# Altium project MCP33151 Eval Board.PrjPcb (part 1 of 3)
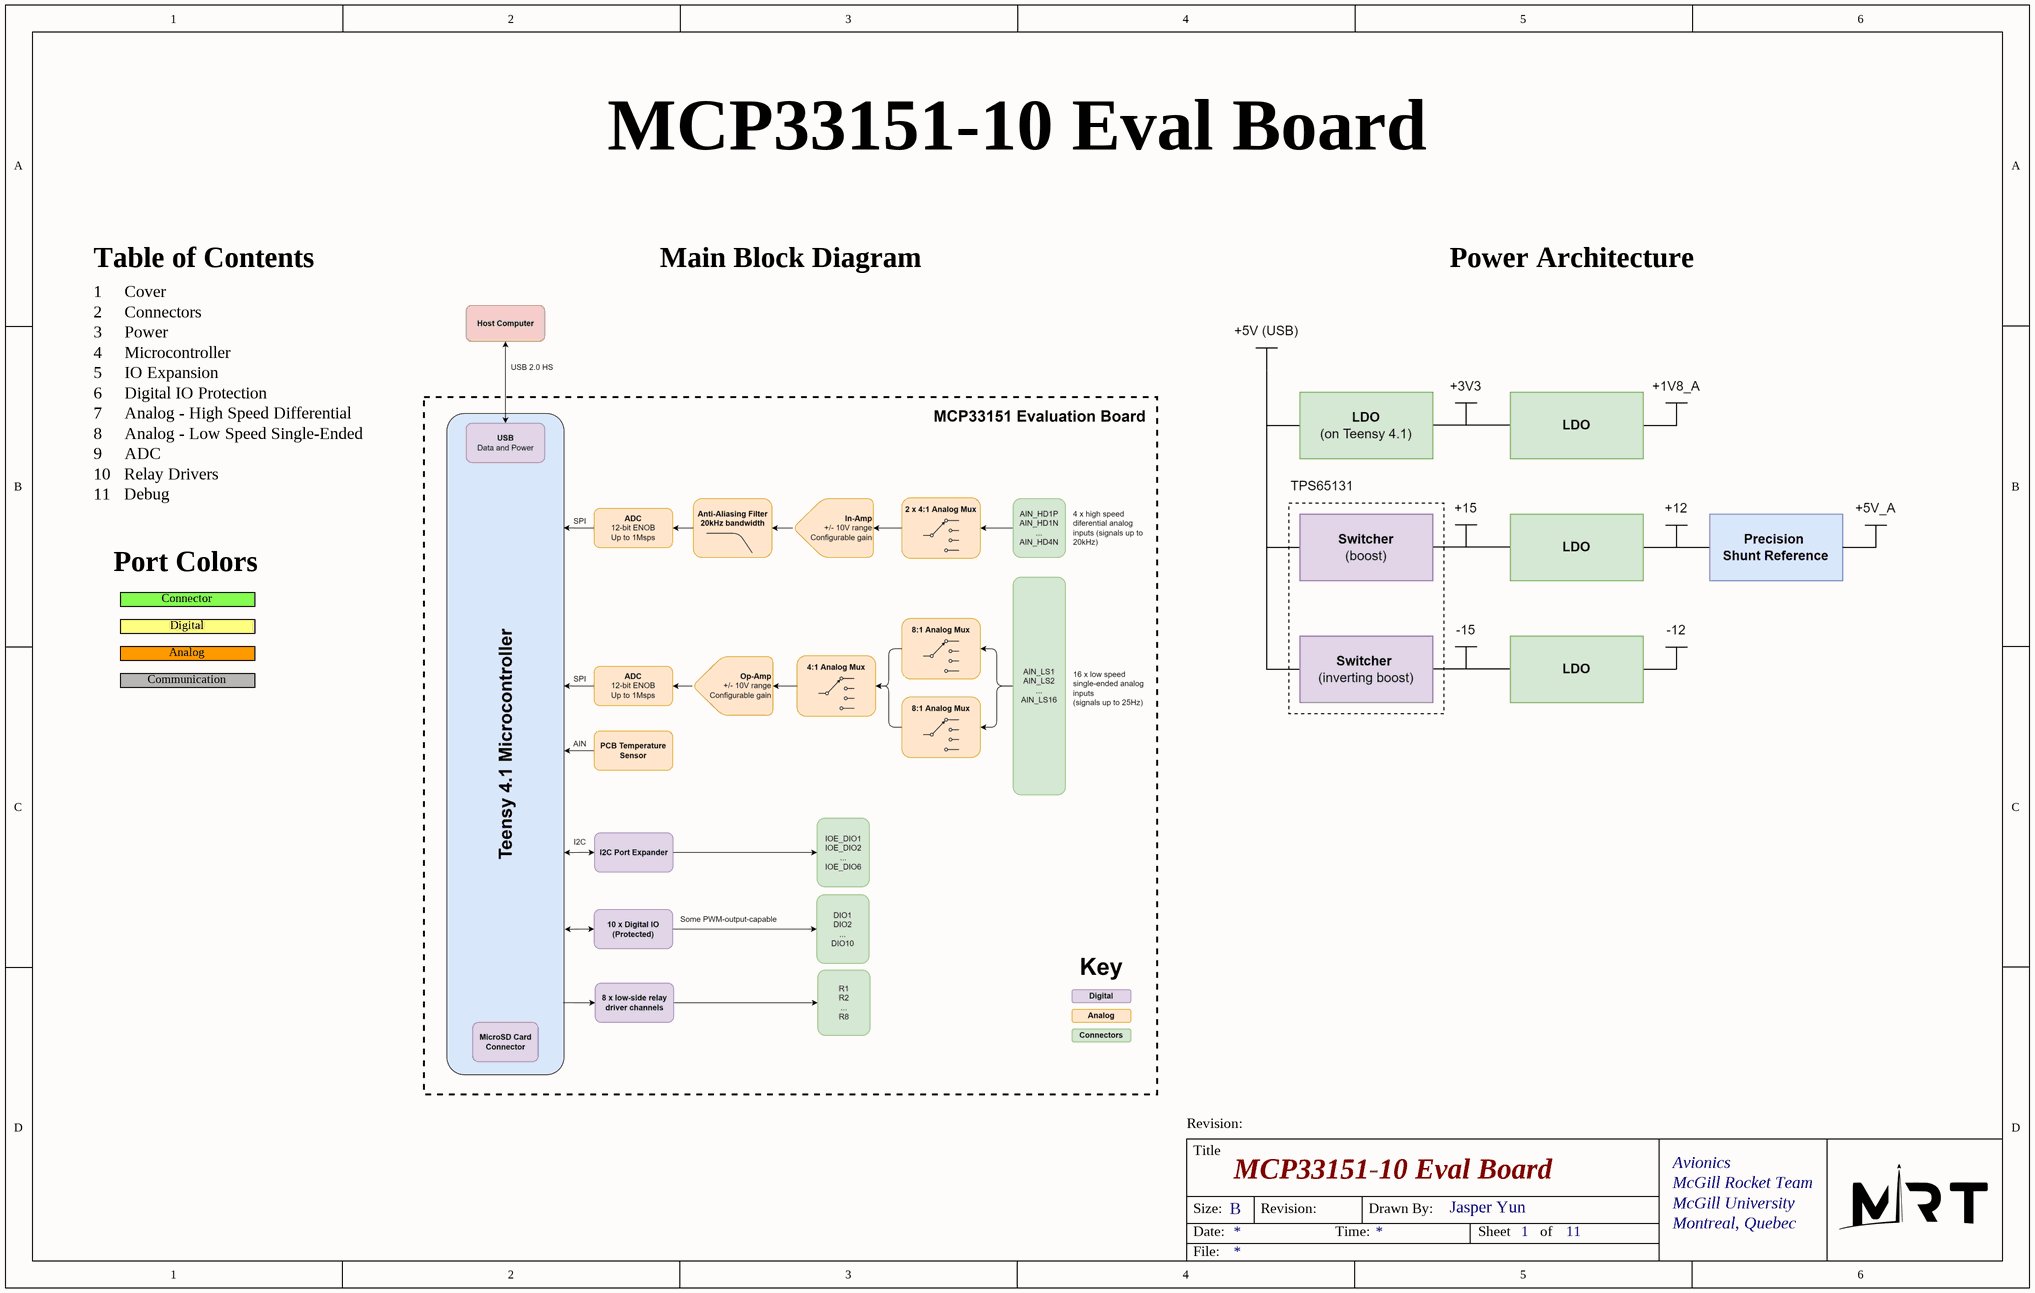
[diagram p0: Cover.SchDoc]
11 sheets, 311 parts. Net scope: flat (ports and power ports of the same name join across sheets).
Board file: MCP33151 Eval Board.PcbDoc
Sheets:
  Cover.SchDoc
  Connectors.SchDoc
  Power.SchDoc
  Microcontroller.SchDoc
  IO Expansion.SchDoc
  Digital IO Protection.SchDoc
  Analog - High Speed DE.SchDoc
  Analog - Low Speed SE.SchDoc
  ADC.SchDoc
  Relay Drivers.SchDoc
  Debug.SchDoc

## Sheet Cover.SchDoc: MCP33151-10 Eval Board
size B; DrawnBy: Jasper Yun; SheetNumber: 1; SheetTotal: 11; Competition: SAC 2021; Subteam: Avionics; University: McGill University; Location: Montreal, Quebec; Project: Avionics Project Name; MRT: McGill Rocket Team

### Notes on the sheet
- Table of Contents
- 1     Cover
- Main Block Diagram
- Power Architecture
- 2     Connectors
- 3     Power
- 4     Microcontroller
- 5     IO Expansion
- 6     Digital IO Protection
- 7     Analog - High Speed Differential
- 8     Analog - Low Speed Single-Ended
- 9     ADC
- 10   Relay Drivers
- 11   Debug
- Port Colors
- Connector
- Digital
- Analog
- Communication
- Title
- Size:
- Date:
- B
- Revision:
- Time:
- Drawn By:
- Sheet
- of
- File:

## Sheet Connectors.SchDoc: Connectors
size B; DrawnBy: Jasper Yun; SheetNumber: 2; SheetTotal: 11; Competition: SAC 2021; Subteam: Avionics; University: McGill University; Location: Montreal, Quebec; Project: Avionics Project Name; MRT: McGill Rocket Team
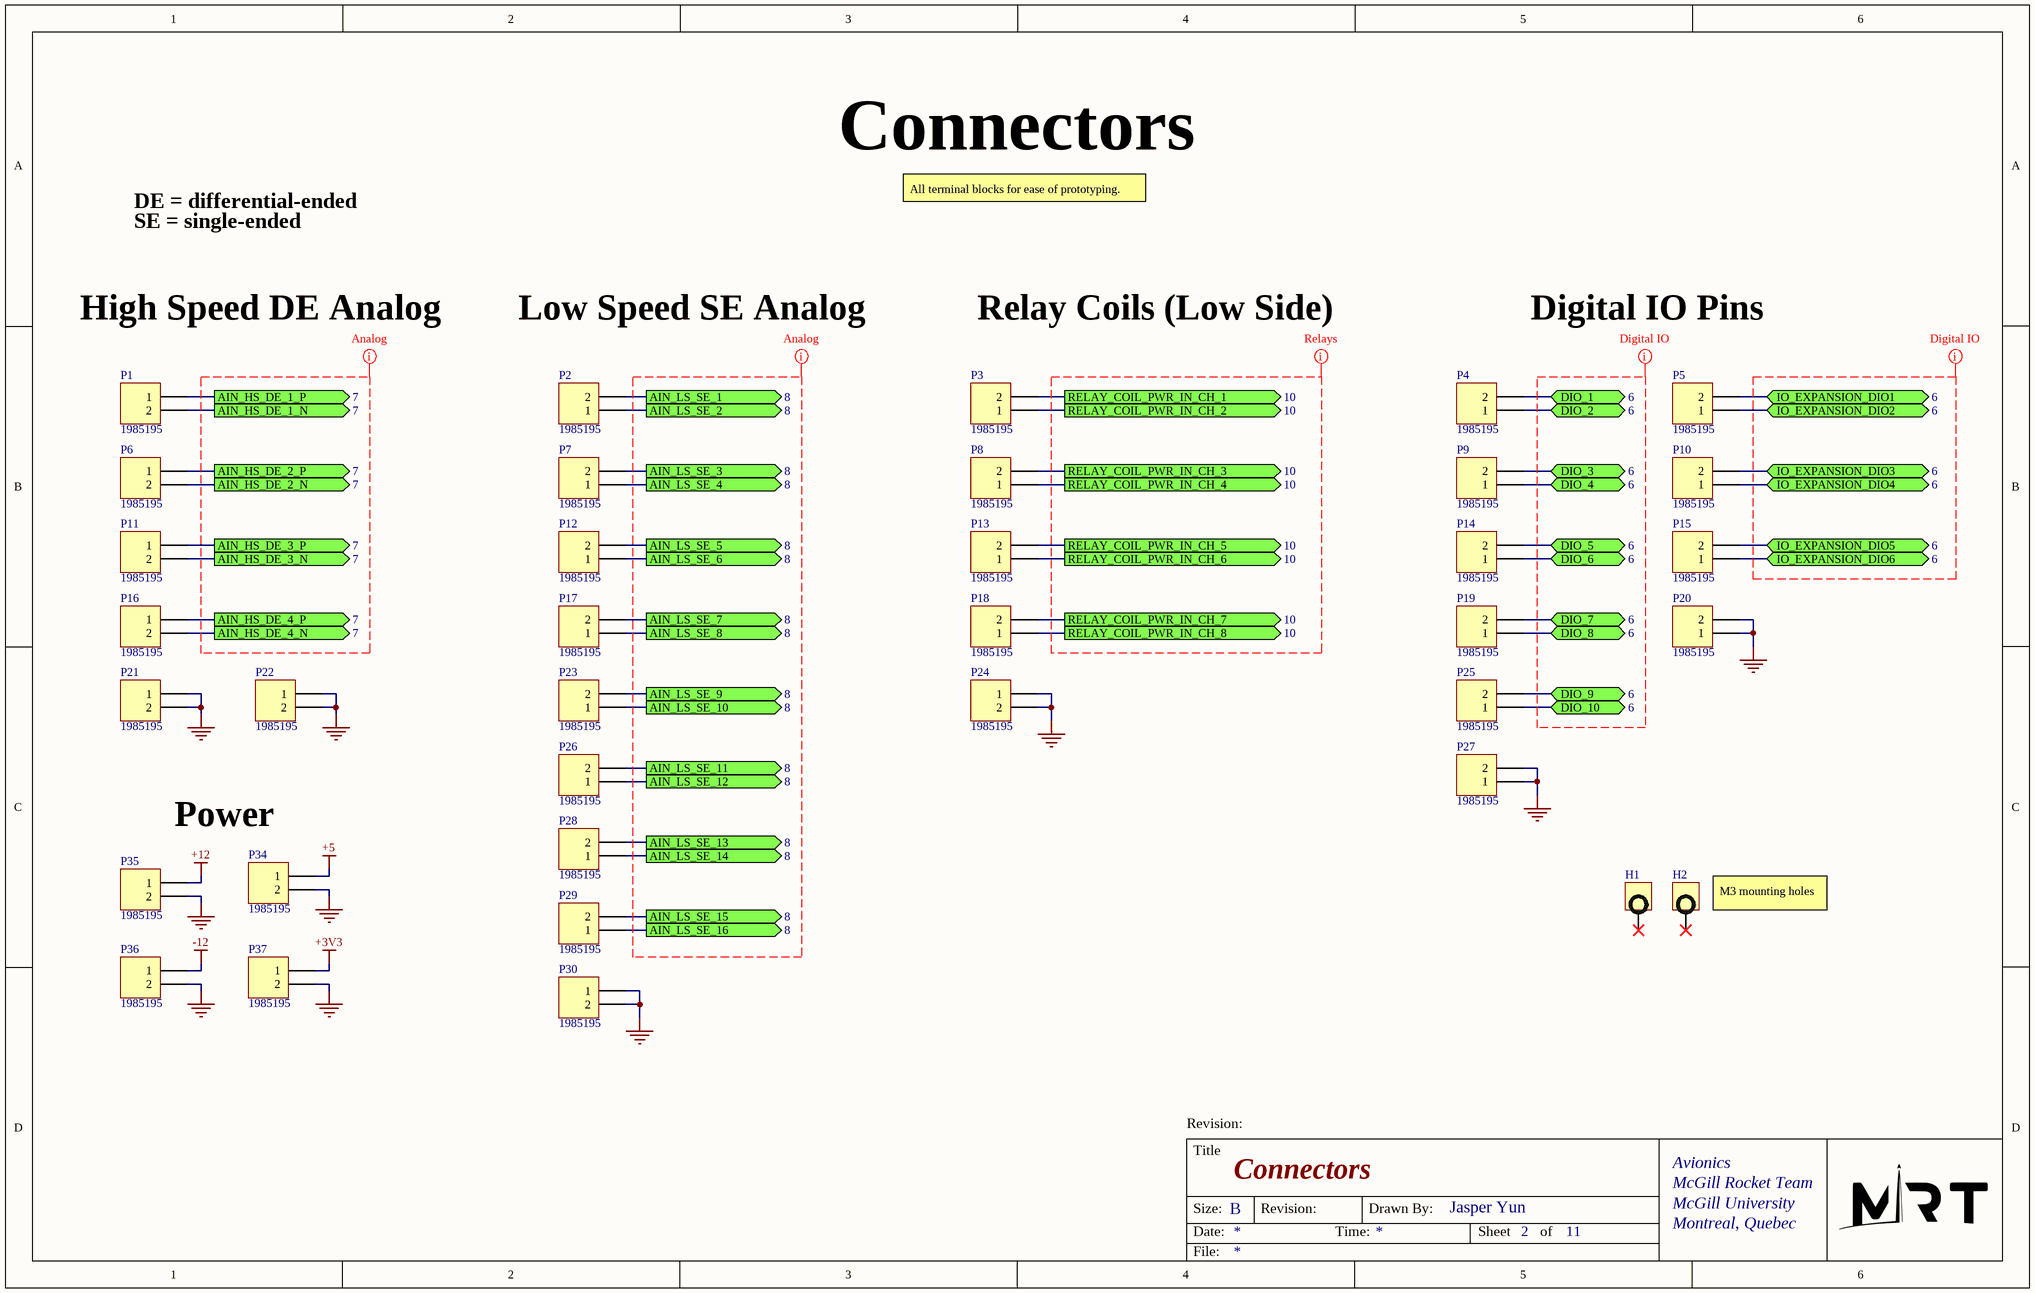
[diagram p1: Connectors.SchDoc]

### Parts
H1  M3  [HOLE M3]  (value not drawn)  (no BOM)
H2  M3  [HOLE M3]  (value not drawn)  (no BOM)
P1  1985195  [Terminal Block 1985195 2-pos 3.5mm pitch]
P2  1985195  [Terminal Block 1985195 2-pos 3.5mm pitch]
P3  1985195  [Terminal Block 1985195 2-pos 3.5mm pitch]
P4  1985195  [Terminal Block 1985195 2-pos 3.5mm pitch]
P5  1985195  [Terminal Block 1985195 2-pos 3.5mm pitch]
P6  1985195  [Terminal Block 1985195 2-pos 3.5mm pitch]
P7  1985195  [Terminal Block 1985195 2-pos 3.5mm pitch]
P8  1985195  [Terminal Block 1985195 2-pos 3.5mm pitch]
P9  1985195  [Terminal Block 1985195 2-pos 3.5mm pitch]
P10  1985195  [Terminal Block 1985195 2-pos 3.5mm pitch]
P11  1985195  [Terminal Block 1985195 2-pos 3.5mm pitch]
P12  1985195  [Terminal Block 1985195 2-pos 3.5mm pitch]
P13  1985195  [Terminal Block 1985195 2-pos 3.5mm pitch]
P14  1985195  [Terminal Block 1985195 2-pos 3.5mm pitch]
P15  1985195  [Terminal Block 1985195 2-pos 3.5mm pitch]
P16  1985195  [Terminal Block 1985195 2-pos 3.5mm pitch]
P17  1985195  [Terminal Block 1985195 2-pos 3.5mm pitch]
P18  1985195  [Terminal Block 1985195 2-pos 3.5mm pitch]
P19  1985195  [Terminal Block 1985195 2-pos 3.5mm pitch]
P20  1985195  [Terminal Block 1985195 2-pos 3.5mm pitch]
P21  1985195  [Terminal Block 1985195 2-pos 3.5mm pitch]
P22  1985195  [Terminal Block 1985195 2-pos 3.5mm pitch]
P23  1985195  [Terminal Block 1985195 2-pos 3.5mm pitch]
P24  1985195  [Terminal Block 1985195 2-pos 3.5mm pitch]
P25  1985195  [Terminal Block 1985195 2-pos 3.5mm pitch]
P26  1985195  [Terminal Block 1985195 2-pos 3.5mm pitch]
P27  1985195  [Terminal Block 1985195 2-pos 3.5mm pitch]
P28  1985195  [Terminal Block 1985195 2-pos 3.5mm pitch]
P29  1985195  [Terminal Block 1985195 2-pos 3.5mm pitch]
P30  1985195  [Terminal Block 1985195 2-pos 3.5mm pitch]
P34  1985195  [Terminal Block 1985195 2-pos 3.5mm pitch]
P35  1985195  [Terminal Block 1985195 2-pos 3.5mm pitch]
P36  1985195  [Terminal Block 1985195 2-pos 3.5mm pitch]
P37  1985195  [Terminal Block 1985195 2-pos 3.5mm pitch]

### Ports
AIN_HS_DE_1_N (out, see 7), AIN_HS_DE_1_P (out, see 7), AIN_HS_DE_2_N (out, see 7), AIN_HS_DE_2_P (out, see 7), AIN_HS_DE_3_N (out, see 7), AIN_HS_DE_3_P (out, see 7), AIN_HS_DE_4_N (out, see 7), AIN_HS_DE_4_P (out, see 7), AIN_LS_SE_1 (out, see 8), AIN_LS_SE_2 (out, see 8), AIN_LS_SE_3 (out, see 8), AIN_LS_SE_4 (out, see 8), AIN_LS_SE_5 (out, see 8), AIN_LS_SE_6 (out, see 8), AIN_LS_SE_7 (out, see 8), AIN_LS_SE_8 (out, see 8), AIN_LS_SE_9 (out, see 8), AIN_LS_SE_10 (out, see 8), AIN_LS_SE_11 (out, see 8), AIN_LS_SE_12 (out, see 8), AIN_LS_SE_13 (out, see 8), AIN_LS_SE_14 (out, see 8), AIN_LS_SE_15 (out, see 8), AIN_LS_SE_16 (out, see 8), DIO_1 (bidir, see 6), DIO_2 (bidir, see 6), DIO_3 (bidir, see 6), DIO_4 (bidir, see 6), DIO_5 (bidir, see 6), DIO_6 (bidir, see 6), DIO_7 (bidir, see 6), DIO_8 (bidir, see 6), DIO_9 (bidir, see 6), DIO_10 (bidir, see 6), IO_EXPANSION_DIO1 (bidir, see 6), IO_EXPANSION_DIO2 (bidir, see 6), IO_EXPANSION_DIO3 (bidir, see 6), IO_EXPANSION_DIO4 (bidir, see 6), IO_EXPANSION_DIO5 (bidir, see 6), IO_EXPANSION_DIO6 (bidir, see 6), RELAY_COIL_PWR_IN_CH_1 (out, see 10), RELAY_COIL_PWR_IN_CH_2 (out, see 10), RELAY_COIL_PWR_IN_CH_3 (out, see 10), RELAY_COIL_PWR_IN_CH_4 (out, see 10), RELAY_COIL_PWR_IN_CH_5 (out, see 10), RELAY_COIL_PWR_IN_CH_6 (out, see 10), RELAY_COIL_PWR_IN_CH_7 (out, see 10), RELAY_COIL_PWR_IN_CH_8 (out, see 10)

### Nets
+3V3: P37.1
+5: P34.1
+12: P35.1
-12: P36.1
GND: P20.1 P20.2 P21.1 P21.2 P22.1 P22.2 P24.1 P24.2 P27.1 P27.2 P30.1 P30.2 P34.2 P35.2 P36.2 P37.2
AIN_HS_DE_1_N: P1.2 ; port AIN_HS_DE_1_N
AIN_HS_DE_1_P: P1.1 ; port AIN_HS_DE_1_P
AIN_HS_DE_2_N: P6.2 ; port AIN_HS_DE_2_N
AIN_HS_DE_2_P: P6.1 ; port AIN_HS_DE_2_P
AIN_HS_DE_3_N: P11.2 ; port AIN_HS_DE_3_N
AIN_HS_DE_3_P: P11.1 ; port AIN_HS_DE_3_P
AIN_HS_DE_4_N: P16.2 ; port AIN_HS_DE_4_N
AIN_HS_DE_4_P: P16.1 ; port AIN_HS_DE_4_P
AIN_LS_SE_1: P2.2 ; port AIN_LS_SE_1
AIN_LS_SE_2: P2.1 ; port AIN_LS_SE_2
AIN_LS_SE_3: P7.2 ; port AIN_LS_SE_3
AIN_LS_SE_4: P7.1 ; port AIN_LS_SE_4
AIN_LS_SE_5: P12.2 ; port AIN_LS_SE_5
AIN_LS_SE_6: P12.1 ; port AIN_LS_SE_6
AIN_LS_SE_7: P17.2 ; port AIN_LS_SE_7
AIN_LS_SE_8: P17.1 ; port AIN_LS_SE_8
AIN_LS_SE_9: P23.2 ; port AIN_LS_SE_9
AIN_LS_SE_10: P23.1 ; port AIN_LS_SE_10
AIN_LS_SE_11: P26.2 ; port AIN_LS_SE_11
AIN_LS_SE_12: P26.1 ; port AIN_LS_SE_12
AIN_LS_SE_13: P28.2 ; port AIN_LS_SE_13
AIN_LS_SE_14: P28.1 ; port AIN_LS_SE_14
AIN_LS_SE_15: P29.2 ; port AIN_LS_SE_15
AIN_LS_SE_16: P29.1 ; port AIN_LS_SE_16
DIO_1: P4.2 ; port DIO_1
DIO_2: P4.1 ; port DIO_2
DIO_3: P9.2 ; port DIO_3
DIO_4: P9.1 ; port DIO_4
DIO_5: P14.2 ; port DIO_5
DIO_6: P14.1 ; port DIO_6
DIO_7: P19.2 ; port DIO_7
DIO_8: P19.1 ; port DIO_8
DIO_9: P25.2 ; port DIO_9
DIO_10: P25.1 ; port DIO_10
IO_EXPANSION_DIO1: P5.2 ; port IO_EXPANSION_DIO1
IO_EXPANSION_DIO2: P5.1 ; port IO_EXPANSION_DIO2
IO_EXPANSION_DIO3: P10.2 ; port IO_EXPANSION_DIO3
IO_EXPANSION_DIO4: P10.1 ; port IO_EXPANSION_DIO4
IO_EXPANSION_DIO5: P15.2 ; port IO_EXPANSION_DIO5
IO_EXPANSION_DIO6: P15.1 ; port IO_EXPANSION_DIO6
RELAY_COIL_PWR_IN_CH_1: P3.2 ; port RELAY_COIL_PWR_IN_CH_1
RELAY_COIL_PWR_IN_CH_2: P3.1 ; port RELAY_COIL_PWR_IN_CH_2
RELAY_COIL_PWR_IN_CH_3: P8.2 ; port RELAY_COIL_PWR_IN_CH_3
RELAY_COIL_PWR_IN_CH_4: P8.1 ; port RELAY_COIL_PWR_IN_CH_4
RELAY_COIL_PWR_IN_CH_5: P13.2 ; port RELAY_COIL_PWR_IN_CH_5
RELAY_COIL_PWR_IN_CH_6: P13.1 ; port RELAY_COIL_PWR_IN_CH_6
RELAY_COIL_PWR_IN_CH_7: P18.2 ; port RELAY_COIL_PWR_IN_CH_7
RELAY_COIL_PWR_IN_CH_8: P18.1 ; port RELAY_COIL_PWR_IN_CH_8

Not connected (* = marked no-connect by the designer): H1 1(TERMINAL)*; H2 1(TERMINAL)*

### Layout directives
net class AIN_HS_DE: (no net found under the mark)
net class AIN_LS_SE: (no net found under the mark)
net class Relays: (no net found under the mark)
net class Digital IO: (no net found under the mark)

### Notes on the sheet
- DE = differential-ended
- SE = single-ended
- All terminal blocks for ease of prototyping.
- High Speed DE Analog
- Low Speed SE Analog
- Relay Coils (Low Side)
- Digital IO Pins
- Power
- (near H2) M3 mounting holes
- Title
- Size:
- Date:
- B
- Revision:
- Time:
- Drawn By:
- Sheet
- of
- File:

### Library data of the parts
H1 H2 = Hole
P1-P30 P34-P37 = Header 2: Header, 2-Pin; LatestRevisionDate: 17-Jul-2002; LatestRevisionNote: Re-released for DXP Platform.; Publisher: Altium Limited

## Sheet Power.SchDoc: Power
size B; DrawnBy: Jasper Yun; SheetNumber: 3; SheetTotal: 11; Competition: SAC 2021; Subteam: Avionics; University: McGill University; Location: Montreal, Quebec; Project: Avionics Project Name; MRT: McGill Rocket Team; SPICEModelCachePJLGTJJW: <root> / <DocumentId>PJLGTJJW</DocumentId> / <CacheFrame Number="0"> / <Model Name="tlv74133p_trans" Kind="CKT"> / <Text>**$ENCRYPTED_LIB / **$INTERFACE / *$ / * TLV74133P / ***************************************************************************** / * (C) Copyright 2017 Texas Instruments Incorporated. All rights reserved. / ***************************************************************************** / ** This model is designed as an aid for customers of Texas Instruments. / ** TI and its licensors and suppliers make no warranties, either expressed / ** or implied, with respect to this model, including the warranties of / ** merchantability or fitness for a particular purpose. The model is / ** provided solely on an "as is" basis. The entire risk as to its quality / ** and performance is with the customer. / ***************************************************************************** / * / ** Released by: WEBENCH Design Center, Texas Instruments Inc. / * Part: TLV74133P / * Date: 18May2017 / * Model Type: Transient / * Simulator: PSPICE / * Simulator Version: 16.2.0.s003 / * EVM Order Number: / * EVM Users Guide: / * Datasheet: / * / * Model Version: Final 1.00 / * / ***************************************************************************** / * / * Updates: / * / * Final 1.00 / * Release to Web / * / ***************************************************************************** / * Model Usage Notes: / * / * 1. The following features have been modeled / *      a. Start-up behaviour is modeled / *      b. Line transients / *      c. Load transients / *      d. Current Limit and current foldback is modeled / *      e. PSRR is modeled only till 1st pole and 1st Zero (Model limitation) / * 2. Quiescent current, noise characteristics and temperature effects are not modeled / ***************************************************************************** / *$ / .SUBCKT TLV74133P_TRANS EN IN OUT GND NC / $CDNENCSTART / eee8c5c7a2bc4b01f045f303678664e7916da0bae22e8cb0bba041dd67c69ce448ea70148a9ac1670c8926c1ac5057c8ccfcd77bf87ca9dc0b4c746fd798d26a / 3ef7762512c2728d26c880f485e2ca342a3c106b023313d28ada37d8d5c7cf52644126c9831a96bdcf2104790de72d3290ec9fe8abf7673c99208d83ebf7835e / 61f0acdd6f1a2e998d23324c429dcbc5041760c3ad23639278b54ce720b1001e7cdcf61de42ce3d848c4805203a5c137bee7ada13b64678567bea335f56363c6 / ddf70eae3b592905a60fd3951de4fe94b329d1ed4b63966290c34a02337a9a58aece49529b1f7d826366b8ad391fd706fad6b9b33c879503dcff4b786816fba0 / 90124f6cbed1c8c0706b807646b80371ffc373d0dda82e245170a8e3336487152c4b5f36edab5d85f319897185d5535e8a21efae9e307b6c3ec926314e3fefa5 / a16523cb4c600880a2f169dd7cb883443cbac3375282bfebbcfdbad4c7a0b23d9c99a6f8ecce348375963efd3ee34e16b032015482838020199902ef25e0ffab / d24b51ea77d68888aece49529b1f7d826366b8ad391fd706fad6b9b33c8795030792eeae181b1b44beb4f1549a7315f36c9d98417bdfb6664d200389545d8b40 / 4b6085f2012636678ee5eab1ce21437b9f9cefdf57bbeb6c020a790a49c0643f9ede7840fd6a39a671b3b397669e727167b79fe510296b6d91e8ee27c5f31f3a / 394197bedeb77a71acab1d0766be876c88df16e4df9fb34693c3b95748fda407020a790a49c0643f9ede7840fd6a39a671b3b397669e72712e7b2aeee83c6f3f / 3b59b36ad64eb5869e6b95464fb772f3a3420d98aed0a149c78e2b5d14e913c21bc90dac9682697462d766f77596a54b020a790a49c0643fe49a60ab4740d6b3 / 86ad213343ec82a92c4cbab0291893203ce9cec0b01d2be1d52509d1cc72a26f23b782b3d6a37df1aece49529b1f7d826366b8ad391fd706707bb47c14a771c8 / 904e90e8e5b2fbfdb9d15c5be4e02d4918754e13dba8dbd33fcc20578536d17e644126c9831a96bdcf2104790de72d3290ec9fe8abf7673c99208d83ebf7835e / 2f646e0e8d7ca9fb860341bb47536c89d3c6f4cd3b9e53669f7df7e1d853713798709113e7ea04d2b5f1c17ee79563032ae3405140756777127e59a57d0b4bc4 / bedb4c285028d3891acdef34d66cba5ce5e7fade4086c0d1994489401db0f447ceeea1f042e441ede71f71e187584171cf2104790de72d3292cbc56994fee090 / c43ca65fb3926f3b26c880f485e2ca3443e01674667ecbfe480b083f93abc69faece49529b1f7d826366b8ad391fd706fad6b9b33c879503dcff4b786816fba0 / a40072fa2b99fd1b706b807646b803712c8fce4fe11cffed06893d1f608340c31a57e3204fc8087fc96625c45fc81f376908c46321d64a826653698ee93a71da / fa68f365a2a9a9bbf60ecfe3dff4fab23ca366a40c90fa0337ed6c52b699ec9ee3e0d0e1c9fb6cda5489a2edd6e7d983dc20eb22577d8ae2e1fbebbbd8524ad9 / cdaa385411811e27bfd81d659a09e4b32637e9cac2aa5cea2cecad1ebf804c4bf467148f06ca8e432ae3405140756777db8bdcea6ac980ec0b07346d43c1325b / 6dcfb6d5e8929f04706b807646b8037110fe20894a82e47899b87aceb23e86970c7e012bffe34f9d2fd4a791317eac01020a790a49c0643fe49a60ab4740d6b3 / 311fb123761f1dd1da8e99d2e05d980afe5c5a072de24811d018ce536f72a8d458b58148317651d22ae3405140756777db8bdcea6ac980ec0b07346d43c1325b / 54653036f112a7e5706b807646b803710e1d0d69cc09017f008dd3578f4a1956bda456e8ba5dde02653b5dcfa0c8c8ae042f0c0c78bb0debad96429cd927e3a7 / 2671091ba70d1568706b807646b80371cbbc9b9c51ccb6540e1d0d69cc09017fa14066b181bb1058427faca47da832a8eccdbc9c173b71e03c54c8fdce812e4c / 593efcd58d475ce138380075bb5248d8aece49529b1f7d826366b8ad391fd706fad6b9b33c8795030792eeae181b1b44beb4f1549a7315f3506f5ad464cab33d / cdaa385411811e27bfd81d659a09e4b32637e9cac2aa5cea2cecad1ebf804c4bf467148f06ca8e432ae3405140756777db8bdcea6ac980ec0b07346d43c1325b / a5d158a0fc11634f706b807646b80371c1d303cdb19fdcef2b9fd23fad97521a56bfede5d11cc7cabee7ada13b646785310b69cdc84fed8f27c911ef3c5c498a / 8df0563ff6b12bcb706b807646b80371c40db3808310b1468d5aa40cb2332d6f855e487a2800314b2ae3405140756777db8bdcea6ac980ec0b07346d43c1325b / 5aa875be979324eb706b807646b8037106893d1f608340c31325fee8f24ce546e71f71e187584171cf2104790de72d3290ec9fe8abf7673c99208d83ebf7835e / 07b8b607253a07a2706b807646b80371e560c959dcca8cd625a084edf9a537bf00877b91cd4279f39377af7e54bb163f9e3e4f75c74b8b1af6c8b208a55c3008 / a3ce589fda26bc39706b807646b803710e1d0d69cc09017f90443e65e9b1b54d83463dd640f012e500d3e0b087c73744bee7ada13b64678567bea335f56363c6 / 4130590ac940df72706b807646b8037195cfd33ccd56f2c7aef5faa9b9d114588de691ddd4293588a32a9f5de4fdf71d60a188d940e604c1ecf22f43cd602b91 / 44286f328a01b55967d2eff95da562744c592bb4da2fa1a8ba08f13bb18f92410cf73d710652a1dc7964efbac1c526ebe8eb3dc18225a2878829e4def662fa7c / 4b6085f2012636678ee5eab1ce21437bcb394d09edfe67a62c4b5f36edab5d85f319897185d5535e8a21efae9e307b6c39aef95345115d28fb7b3c5aa7521e2a / 6dcc2999c2dfe559706b807646b803715848080d04576310931deb2ad43d855bdaf6279e60479f513ca366a40c90fa0337ed6c52b699ec9ead65093cc772bc07 / 0be1bd08545f4ec3706b807646b803719b4317da4cfba3b11a36b4f98b9d0a824c592bb4da2fa1a8ba08f13bb18f92410cf73d710652a1dc857994194d945adf / 385bb969478bc1fd7509c136893a3e2e2688e0dfc494de0fa05c5098b4f2d71d6790562ac97fa9372b39496d8eed4513192fb0130cd26ef2491c3f072e96755f / 33b35530770e96c3020a790a49c0643f9ede7840fd6a39a671b3b397669e727167b79fe510296b6d7fc7fe1724ee00a8e5b73a7f8e9611b36957c72a5f702f99 / 6700a2a6ef061025e5db8de19cca6808da00941f567143647ec4baa2e3f12776b5f1c17ee79563032ae3405140756777db8bdcea6ac980ec0b07346d43c1325b / 69ff18044fae7c89706b807646b803710e1d0d69cc09017f83db50ce616e99681d4e452fee093da42ae3405140756777db8bdcea6ac980ec0b07346d43c1325b / 6bc6bcfc0cf717f3706b807646b803710e1d0d69cc09017f9f6f26d8292ed07737a6a454c38136f2bee7ada13b646785310b69cdc84fed8f27c911ef3c5c498a / 02dac6cba784505e706b807646b80371e13768767d1ad4df6d2099228887f927c7b3ca07e03285463e67e48cb17c169bf357d2495314aea2abb485c8ac7a39ac / 9e700d1bd10bd6d1706b807646b80371ed5711e40d45802b61698dfbf8657ce6fec09a3dc3f5b4bc66d837958b36832c4c592bb4da2fa1a8f7aec25d7f708173 / f28257b2a3730294706b807646b80371c1d303cdb19fdcef2b9fd23fad97521a5699b53886fa29b6bee7ada13b646785310b69cdc84fed8f27c911ef3c5c498a / e9f419af62bfe95ebc27f931268b4061819f482ced2d14da2c71c45202431155ce5ec34e6f8ad1cac13ffc8b6ae5cb2e4a2edc29a53e23e5909669e0b73a8f95 / 5d078000650a8fa5fdb2fa9c3b6939f20665193f98f36aacffec3124ac57d11d8675a01b2db95be7bee7ada13b646785310b69cdc84fed8f27c911ef3c5c498a / e9f419af62bfe95ecc0121b5e20e2076819f482ced2d14dab26871b2b1938100ce5ec34e6f8ad1cac1550d7a244ac219a4daa95c07252e71d38aff4e12555a5d / 0a74212461f65cb941623afbc4370720e6de3ee6a0c7ca59294ff995b8f67f653ca366a40c90fa0337ed6c52b699ec9ee3e0d0e1c9fb6cda153de17b096719c0 / bc8ee2299b220803beda7935c8aeca8d90d894e251243331dc0745283a910a9d4c592bb4da2fa1a8ba08f13bb18f92410cf73d710652a1dc857994194d945adf / e9f419af62bfe95edca29065f7b4a684696ce76c04a2281e749d13634498f34b6f49004d18e3f79a6e50180630c94e30a0dc0d49a7822e99d164c99c042b1bf7 / 6ac9a0759edf463767088d86df747f60bee7ada13b646785310b69cdc84fed8fd2644a0c7a1f6653715e1eef0b72abfaeada256628d9fa61a787a16be87366e6 / 8567fa61d0589ca2c1fb5ea162ffd514e71f71e187584171cf2104790de72d3290ec9fe8abf7673c970e3472bd46494a4e473918de3a7445e2df95f2ca454947 / afe317ae10e98155a2f169dd7cb88344fc17600d62a6be62651ce840812926c2a0037b483206f0537704591a7ab83b388b76e1023bea0c1650794576b4f63d0d / 5e907deffd12c5ffdd06c2baef735cae36806a8e381bf9a0cf2104790de72d3290ec9fe8abf7673c970e3472bd46494a4e473918de3a7445e2df95f2ca454947 / 8767f397bff4c3a731bbfa71d5efb6fe825b843a3aa9ddcdbee7ada13b646785310b69cdc84fed8fd2644a0c7a1f6653715e1eef0b72abfa55f88976ddff33c2 / bcd47878fdf46051706b807646b80371e71d04604f91d63b8492e52ca9907137c32e32cca6618f9fbba78e549769b5b6a2b4ff936e38a05e5ba162f215351813 / e6a326a14082b2f49de538e0e17f3b612cb13c1144feac5836fb420f5a067a1e020a790a49c0643f9ede7840fd6a39a671b3b397669e72712e7b2aeee83c6f3f / 065d26286aaf2f122531ce9df5eb0603cdb79a754752616577946fa90ac97f1623b782b3d6a37df1aece49529b1f7d826366b8ad391fd706707bb47c14a771c8 / 81bc0cb7c12452449e6b95464fb772f30fee6b11c20909b67a1e30009c1ce0bb97d0bdc16e1372b18dcea2cdd2d3d5cc9783ae8e4821c68fb9549840541e7e65 / 2b1410deca799d73020a790a49c0643f9ede7840fd6a39a671b3b397669e727167b79fe510296b6d7fc7fe1724ee00a8e5b73a7f8e9611b36957c72a5f702f99 / 4b6085f2012636678ee5eab1ce21437bcb394d09edfe67a62c4b5f36edab5d85f319897185d5535e8a21efae9e307b6c39aef95345115d28fb7b3c5aa7521e2a / 81a9746d786d11d64597b28a3abd988012ddce7625ce8b749a817b57fafd1477b796b84db146c932d2bbd7e847d638e1e776e9b255bda08c8cc849879194c8ab / 021166ac3753b7b82c4b5f36edab5d85f319897185d5535e8a21efae9e307b6c39aef95345115d28a4e86a2b8ce1a15c876aa96db62f570e4728da9b5d57d060 / 4b6085f2012636675a0aa31c52cddba976617f42cd5d956bcf2104790de72d3290ec9fe8abf7673c970e3472bd46494a4e473918de3a7445e2df95f2ca454947 / fe9073afece57ff8706b807646b80371840b46a3c196863a8492e52ca9907137c32e32cca6618f9fe2b513f28f5cc45e8ae977c83ed93ca01a4b3a4aa1a53d39 / b5f1c17ee79563032ae3405140756777db8bdcea6ac980ec33aa61ed5dfd1615a2b953758ae0653997413343c5173f709a7fe0de77cfb358e852ad9deb7e5829 / 171d979aaf3d706b8036d105784414182421587c0f57824df28c20f9309a199907f8501aec60f8d72c4b5f36edab5d85f319897185d5535ea3db9509eaaedb86 / 62748d827ca277c7706b807646b80371f8483db7077f00d88492e52ca9907137c32e32cca6618f9f3f95ac6a6abeffa557ca4629d8e4d1d5c706f9f16c578ebd / 9a5ec75040f406dfaece49529b1f7d826366b8ad391fd706fad6b9b33c8795030792eeae181b1b44beb4f1549a7315f36c9d98417bdfb6664d200389545d8b40 / dcebf7f9574ab91a6d2aa86b77a26c95b5f1c17ee79563032ae3405140756777db8bdcea6ac980ec33aa61ed5dfd1615a2b953758ae06539f0d4404e9eae4543 / c9df73872fc60450f79767d8efdc77048036d10578441418c3b36018e345e16ea9d370a6c76a86b1c95c6e3ee2b90bc64c592bb4da2fa1a8f7aec25d7f708173 / 2a76c18f665e8c272c4cbab029189320d042b92eba138a7c9f7df7e1d8537137dc26028ef70590f4b5f1c17ee79563032ae3405140756777127e59a57d0b4bc4 / b052355e65d40bda4d945ab16ce19c1c84ddacec780ae998d1329743685553f552abd955e62c0758641d3019da38fe062ae3405140756777127e59a57d0b4bc4 / 316c4e958281b805388657e9d51604f7d042b92eba138a7c9f7df7e1d85371374e5ddb18d203799eb5f1c17ee79563032ae3405140756777127e59a57d0b4bc4 / 93d3808648446fd760c210771409cb2e6d636f62dc811967b531fdb8889633b4bf1ee911780421dd2ae3405140756777db8bdcea6ac980ec0b07346d43c1325b / abc05a84349f7fe5c4a87854647e1c4d7a2cf28d9fad6470b68795307ca378132c4b5f36edab5d85f319897185d5535e8a21efae9e307b6c3ec926314e3fefa5 / d674c3790d07122b11a38be6e728d86571fdfa3b9479815f35cddce08a7c8e49aad0cae5ebf3019acf2104790de72d3290ec9fe8abf7673c99208d83ebf7835e / 98b5f0d56fa74586371dd2737e0b85bb17699167bed26af3ef0469327ad2d651c070e39803c5b7f2644126c9831a96bdcf2104790de72d3292cbc56994fee090 / 560bc4dfcba57a2c4597b28a3abd9880546126e99c25f83666eaeb9fc4cc8ae1a506802e3014c1ec3efcea856e03cbcb020a790a49c0643fe49a60ab4740d6b3 / 635adb6c201b6ba1dc5a1b22284dea7f7269e4f26708c1f5e15414253a7581d723b782b3d6a37df1aece49529b1f7d826366b8ad391fd706707bb47c14a771c8 / 04f5acd939422ec02fbfcc2b872ff946c84ddf640b93507bce5ec34e6f8ad1ca6e02cd619ff2cf87bba78e549769b5b69df1af93d6544d48084e1162bd10742f / 8f87abf34a7ecbdc37080f586b2fbb9f644126c9831a96bdcf2104790de72d3290ec9fe8abf7673c970e3472bd46494a4e473918de3a7445e2df95f2ca454947 / 3e2f6d3b6fa1f79ebee7ada13b646785310b69cdc84fed8fd2644a0c7a1f6653715e1eef0b72abfaeada256628d9fa6105ada24893efbf7db502a1ba211b9cf5 / e83d563d614d5ce9a2f169dd7cb88344dd754eba74fd38c68cd7aeb0417ec42b478a87bc5b8e6cf92c4b5f36edab5d85f319897185d5535ea3db9509eaaedb86 / 9afa1f10a7f457ea9c68ca010600ec3f08ae2aac6c0aefcf5fa3b0d8aac7c8ab64bcc0a497fc04ba3ca366a40c90fa0337ed6c52b699ec9ead65093cc772bc07 / 102778d1f868b7a49e6b95464fb772f3f67259042900919200877b91cd4279f3e858241bec91ac5932f4f6e343e2740ce71f71e1875841710bbd919f40ea0a91 / 7aff1ed17501806211a38be6e728d865dae2ce7659f8ae488431538b2a67818faece49529b1f7d826366b8ad391fd706fad6b9b33c879503dcff4b786816fba0 / 5c2e262d493b312fa7aa53100c9e1bbea947b049e5632dc590449a6411b06b9bddaaa86168801b89710f626c2faf14a62ae3405140756777127e59a57d0b4bc4 / b0eb42ca922cce592fbfcc2b872ff94636ea5db477834f11ce5ec34e6f8ad1ca4a00a148cfaed3410d0123120ac936d82594fc6756c8b3f583a3a146f650f598 / 39438c6af260813937080f586b2fbb9f644126c9831a96bdcf2104790de72d3290ec9fe8abf7673c970e3472bd46494a4e473918de3a7445e2df95f2ca454947 / 3e2f6d3b6fa1f79ebee7ada13b646785310b69cdc84fed8fd2644a0c7a1f6653715e1eef0b72abfaeada256628d9fa6105ada24893efbf7db502a1ba211b9cf5 / 240cf6a83072ff1ac71f2ec08efb7527e669cd180bf3e26a3cafa1326cfe1874949d6e4437d829a1bf659a476171f3dc4c592bb4da2fa1a8f7aec25d7f708173 / 311fb123761f1dd129c75dcdf45ee2c9184d51289dba83b9873e8e5ec9278a4fdd037aafe640141b53af89050c52dda0986d8eb4dc61f09ccd81523dba430406 / 857620ce20ef86cb26c880f485e2ca343bb1a3b1207c1c81ec673e334d6e7ccd24fdfd9bb2e10b073ca366a40c90fa0337ed6c52b699ec9ead65093cc772bc07 / e0bee0f3fadd672460c210771409cb2e6d636f62dc811967f24bf58ddadd36c75fbceec05a2e4b3f7d7f15953a32e2dc2c4b5f36edab5d8551199e6b857bd9bb / 705d459f50f7a08ca2f169dd7cb88344af02b8d90c64a20083463dd640f012e500d3e0b087c73744bee7ada13b646785310b69cdc84fed8f27c911ef3c5c498a / 23ee73d6065f364126c880f485e2ca34bb994c8b62ecb3d556bfede5d11cc7cabee7ada13b646785310b69cdc84fed8fd2644a0c7a1f66532b9d75a20e81bbc9 / 5ff44a992c4e2ee3dc5a1b22284dea7f22619596979187a5def26a02973838a2aece49529b1f7d826366b8ad391fd706fad6b9b33c879503dcff4b786816fba0 / 3bdfb3bcf8540f57c4a87854647e1c4d5d8a3d237bfb39ae1de333fbd2e0f35d2ae3405140756777db8bdcea6ac980ec33aa61ed5dfd1615938a028feea6b6ab / 8f10d309634521e54597b28a3abd9880ebd3a03647eb9b9894002bb68e8267dd50932f91c29cb99b710f626c2faf14a62ae3405140756777127e59a57d0b4bc4 / c0ff0c48b49f7f339e6b95464fb772f30aba9e7e21195c650903cac0925c6772478a87bc5b8e6cf92c4b5f36edab5d85f319897185d5535ea3db9509eaaedb86 / 0dea85bdd2f6170572244c37edb8c9a57c97cea512c6127aa1a283936dd7cb703ca366a40c90fa0337ed6c52b699ec9ee3e0d0e1c9fb6cda153de17b096719c0 / b8b56863f55c875e94fbbbfac28a5c5cb686a80b117e185d78b54ce720b1001e5702f8045be5988d48c4805203a5c137bee7ada13b64678567bea335f56363c6 / b90e0c5fe970b38760c210771409cb2ef939b0ee93e9a0c2fd398b77382f2c3d5fa3b0d8aac7c8abe7974be90fc4014564bcc0a497fc04bab2a3b9742409977c / 48a94d11d238250fc31b79b9fb81119cccb2db67557ffe5198d4cacdd01bc2de3ac5545db54f890b3f15d752ad08f63f020a790a49c0643fe49a60ab4740d6b3 / 717cdf892ff6b6ffa60fd3951de4fe94f62cc45356863029bf1ee911780421dd2ae3405140756777db8bdcea6ac980ec33aa61ed5dfd1615938a028feea6b6ab / 615a28c46d723740a2f169dd7cb88344d1eba1bd85eddbc90a0ec22218277ba4bf1ee911780421dd2ae3405140756777db8bdcea6ac980ec0b07346d43c1325b / f80a395284a571112fbfcc2b872ff946e00e80a1258e7bf6ce5ec34e6f8ad1caa70718c54ca105391764c88c178ac69b6d2aa86b77a26c951aabfa10941d45cf / 2cfd781695004e380b22971992301099af875caab1306b6ed124cb96fac5ac60a3afba3b2717dabc3e61460e307bde4710af332b9667bcfad020173982ed1cba / 9a45d9d494e43254a129f2477c5055a1bee7ada13b646785310b69cdc84fed8fd2644a0c7a1f6653715e1eef0b72abfaeada256628d9fa61a787a16be87366e6 / 62de40c9486cbee4fdd8918a90e8c397bd1f26a14863c7ed23463771f33aae2813aa0fddd8a96f49efe85a592a0b5b6a8ad03f6ac88933cd16df2a1bd2dfca10 / $CDNENCFINISH / .ends TLV74133P_TRANS</Text> / </Model> / </CacheFrame> / </root>
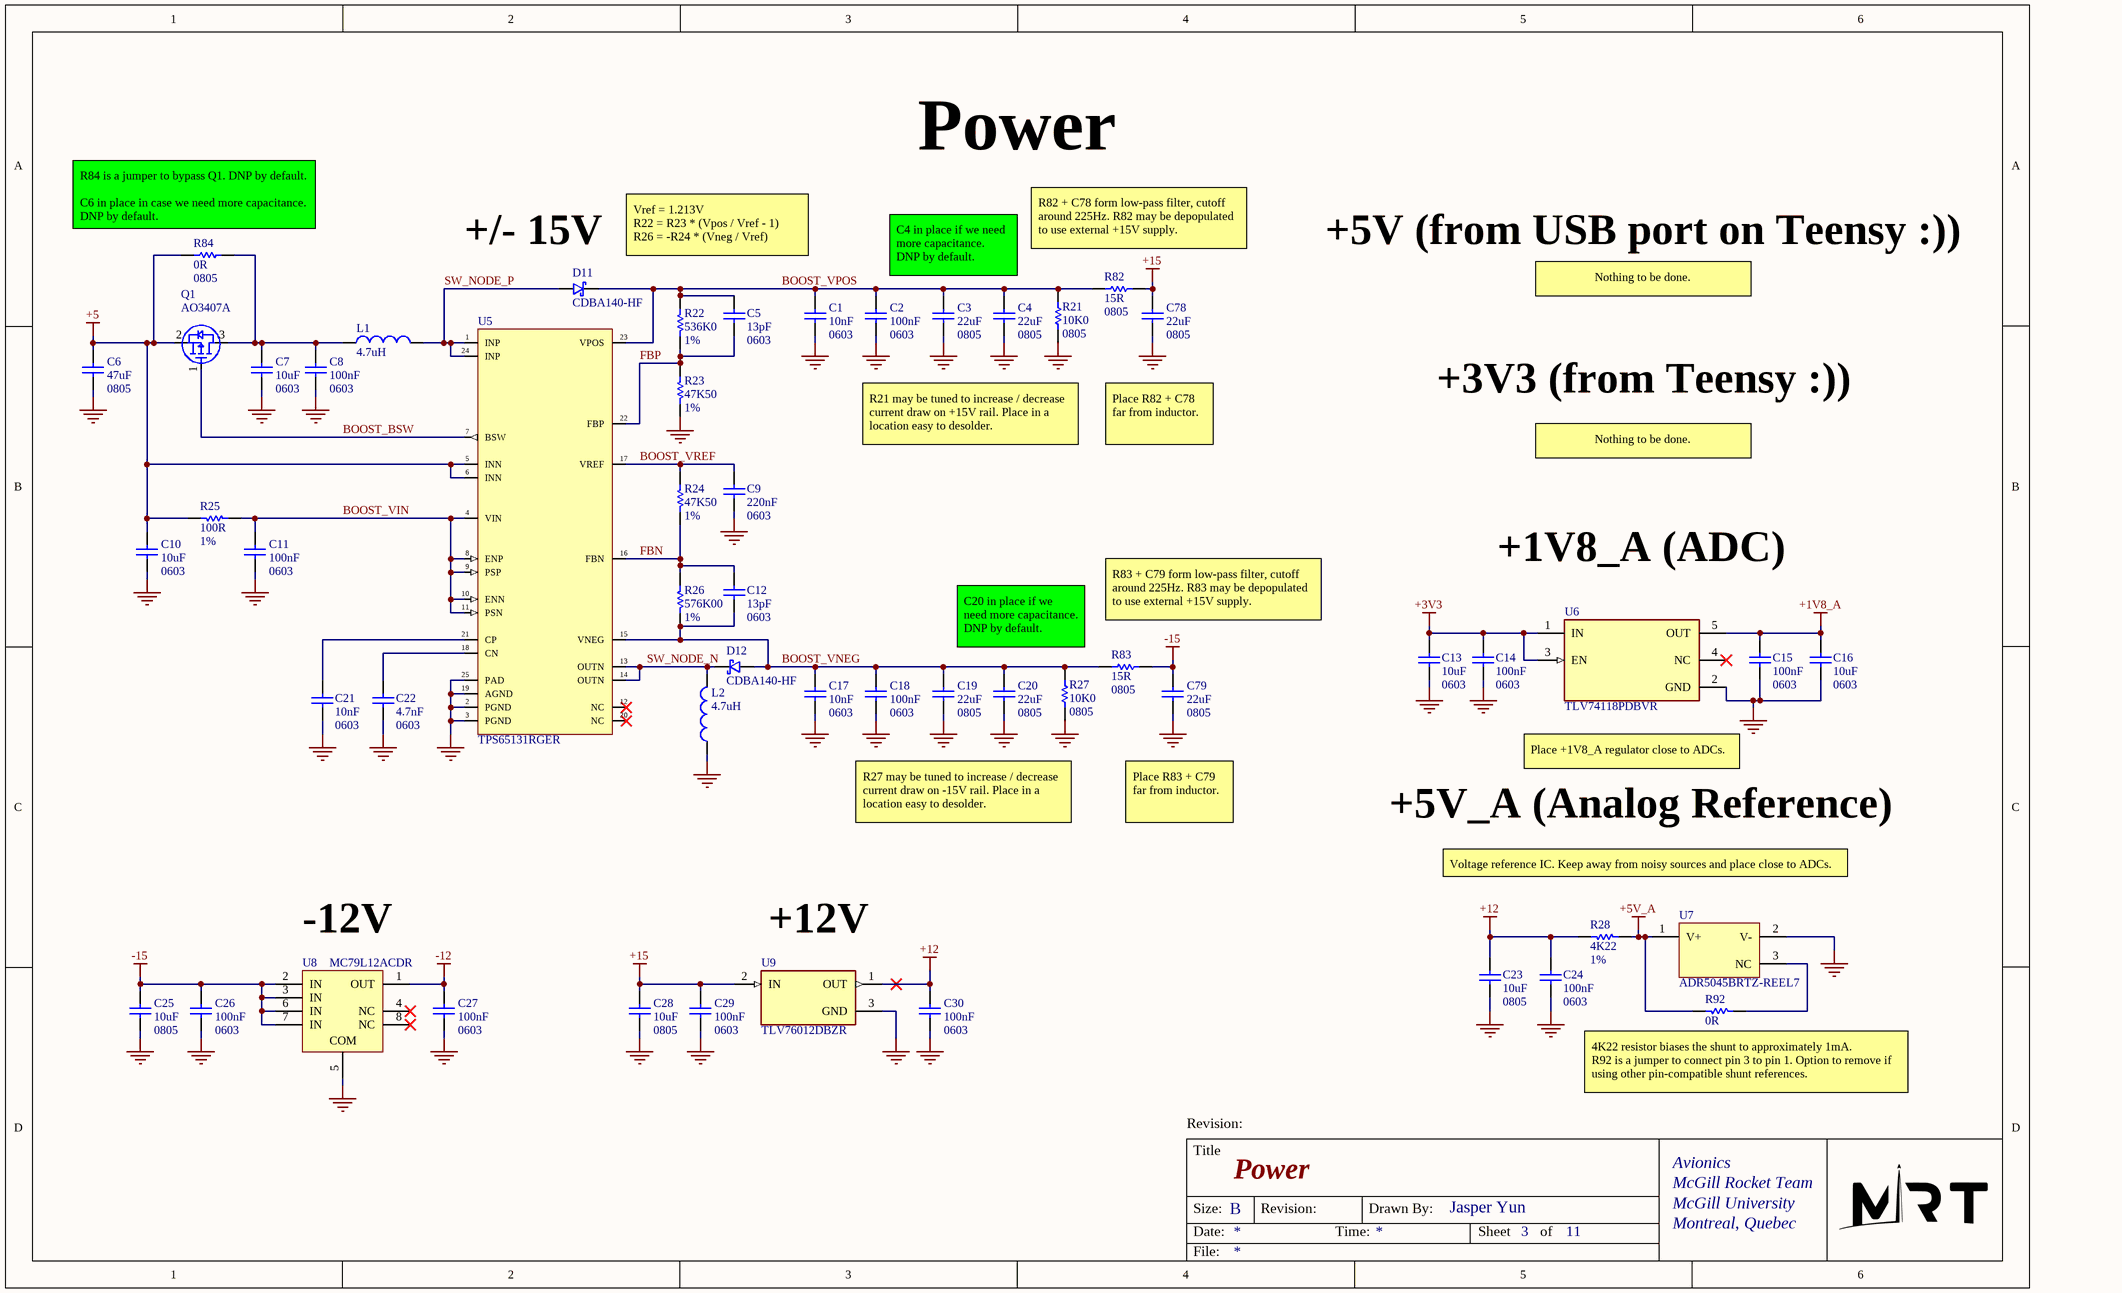
[diagram p2: Power.SchDoc]

### Parts
C1  10nF  value 0603  [0603 CAP SAMSUNG CL10C]
C2  100nF  value 0603  [0603 CAP SAMSUNG CL10C]
C3  22uF  value 0805  [0805 CAP]
C4  22uF  value 0805  [0805 CAP]
C5  13pF  value 0603  [0603 CAP SAMSUNG CL10C]
C6  47uF  value 0805  [0805 CAP]
C7  10uF  value 0603  [0603 CAP SAMSUNG CL10C]
C8  100nF  value 0603  [0603 CAP SAMSUNG CL10C]
C9  220nF  value 0603  [0603 CAP SAMSUNG CL10C]
C10  10uF  value 0603  [0603 CAP SAMSUNG CL10C]
C11  100nF  value 0603  [0603 CAP SAMSUNG CL10C]
C12  13pF  value 0603  [0603 CAP SAMSUNG CL10C]
C13  10uF  value 0603  [0603 CAP SAMSUNG CL10C]
C14  100nF  value 0603  [0603 CAP SAMSUNG CL10C]
C15  100nF  value 0603  [0603 CAP SAMSUNG CL10C]
C16  10uF  value 0603  [0603 CAP SAMSUNG CL10C]
C17  10nF  value 0603  [0603 CAP SAMSUNG CL10C]
C18  100nF  value 0603  [0603 CAP SAMSUNG CL10C]
C19  22uF  value 0805  [0805 CAP]
C20  22uF  value 0805  [0805 CAP]
C21  10nF  value 0603  [0603 CAP SAMSUNG CL10C]
C22  4.7nF  value 0603  [0603 CAP SAMSUNG CL10C]
C23  10uF  value 0805  [0805 CAP]
C24  100nF  value 0603  [0603 CAP SAMSUNG CL10C]
C25  10uF  value 0805  [0805 CAP]
C26  100nF  value 0603  [0603 CAP SAMSUNG CL10C]
C27  100nF  value 0603  [0603 CAP SAMSUNG CL10C]
C28  10uF  value 0805  [0805 CAP]
C29  100nF  value 0603  [0603 CAP SAMSUNG CL10C]
C30  100nF  value 0603  [0603 CAP SAMSUNG CL10C]
C78  22uF  value 0805  [0805 CAP]
C79  22uF  value 0805  [0805 CAP]
D11  CDBA140-HF  [Diode SMA]
D12  CDBA140-HF  [Diode SMA]
L1  4.7uH  [Inductor BWVS005050403R3M00]
L2  4.7uH  [Inductor BWVS005050403R3M00]
Q1  AO3407A  [SOT23-3]
R21  10K0  value 0805  [0805 RES]
R22  536K0  value 1%  [0603 RES]
R23  47K50  value 1%  [0603 RES]
R24  47K50  value 1%  [0603 RES]
R25  100R  value 1%  [0603 RES]
R26  576K00  value 1%  [0603 RES]
R27  10K0  value 0805  [0805 RES]
R28  4K22  value 1%  [0603 RES]
R82  15R  value 0805  [0805 RES]
R83  15R  value 0805  [0805 RES]
R84  0R  value 0805  [0805 RES]
R92  0R  [0603 RES]
U5  TPS65131RGER  [VQFN-24]
U6  TLV74118PDBVR  [FP-DBV0005A-IPC_A]
U7  ADR5045BRTZ-REEL7  [ADI-RT-3_M]
U8  MC79L12ACDR  [D0008A_M]
U9  TLV76012DBZR  [FP-DBZ0003A-IPC_A]

### Nets
+1V8_A: C15.2 C16.2 U6.5(OUT)
+3V3: C13.2 C14.2 U6.1(IN) U6.3(EN)
+5: C6.2 C10.2 Q1.2(Source) R25.1 R84.2 U5.5(INN) U5.6(INN)
+5V_A: R28.2 R92.1 U7.1(V+)
+12: C23.2 C24.2 C30.2 R28.1 U9.1(OUT)
+15: C28.2 C29.2 C78.2 R82.1 U9.2(IN)
-12: C27.2 U8.1(OUT)
-15: C25.2 C26.2 C79.2 R83.1 U8.2(IN) U8.3(IN) U8.6(IN) U8.7(IN)
GND: C1.1 C2.1 C3.1 C4.1 C6.1 C7.1 C8.1 C9.2 C10.1 C11.1 C13.1 C14.1 C15.1 C16.1 C17.1 C18.1 C19.1 C20.1 C21.1 C22.1 C23.1 C24.1 C25.1 C26.1 C27.1 C28.1 C29.1 C30.1 C78.1 C79.1 L2.1 R21.1 R23.2 R27.1 U5.2(PGND) U5.3(PGND) U5.19(AGND) U5.25(PAD) U6.2(GND) U7.2(V-) U8.5(COM) U9.3(GND)
BOOST_BSW: Q1.1(Gate) U5.7(BSW)
BOOST_VIN: C11.2 R25.2 U5.4(VIN) U5.8(ENP) U5.9(PSP) U5.10(ENN) U5.11(PSN)
BOOST_VNEG: C12.1 C17.2 C18.2 C19.2 C20.2 D12.2(Anode) R26.1 R27.2 R83.2 U5.15(VNEG)
BOOST_VPOS: C1.2 C2.2 C3.2 C4.2 C5.1 D11.1(Cathode) R21.2 R22.1 R82.2 U5.23(VPOS)
BOOST_VREF: C9.1 R24.1 U5.17(VREF)
FBN: C12.2 R24.2 R26.2 U5.16(FBN)
FBP: C5.2 R22.2 R23.1 U5.22(FBP)
SW_NODE_N: D12.1(Cathode) L2.2 U5.13(OUTN) U5.14(OUTN)
SW_NODE_P: D11.2(Anode) L1.2 U5.1(INP) U5.24(INP)
NetC7_2: C7.2 C8.2 L1.1 Q1.3(Drain) R84.1
NetC21_2: C21.2 U5.21(CP)
NetC22_2: C22.2 U5.18(CN)
NetR92_2: R92.2 U7.3(NC)

Not connected (* = marked no-connect by the designer): U5 12(NC)* 20(NC)*; U6 4(NC)*; U8 4(NC)* 8(NC)*

### Notes on the sheet
- (near R84) R84 is a jumper to bypass Q1. DNP by default.
  C6 in place in case we need more capacitance. DNP by default.
- (near D11) +/- 15V
- Vref = 1.213V
  R22 = R23 * (Vpos / Vref - 1)
  R26 = -R24 * (Vneg / Vref)
- C4 in place if we need more capacitance. DNP by default.
- R82 + C78 form low-pass filter, cutoff around 225Hz. R82 may be depopulated to use external +15V supply.
- +5V (from USB port on Teensy :))
- Nothing to be done.
- +3V3 (from Teensy :))
- R21 may be tuned to increase / decrease current draw on +15V rail. Place in a location easy to desolder.
- Place R82 + C78 far from inductor.
- +1V8_A (ADC)
- C20 in place if we need more capacitance. DNP by default.
- R83 + C79 form low-pass filter, cutoff around 225Hz. R83 may be depopulated to use external +15V supply.
- Place +1V8_A regulator close to ADCs.
- R27 may be tuned to increase / decrease current draw on -15V rail. Place in a location easy to desolder.
- Place R83 + C79 far from inductor.
- +5V_A (Analog Reference)
- Voltage reference IC. Keep away from noisy sources and place close to ADCs.
- (near U8) -12V
- (near U9) +12V
- (near R92) 4K22 resistor biases the shunt to approximately 1mA.
  R92 is a jumper to connect pin 3 to pin 1. Option to remove if using other pin-compatible shunt references.
- Title
- Size:
- Date:
- B
- Revision:
- Time:
- Drawn By:
- Sheet
- of
- File:

### Library data of the parts
C1-C30 C78 C79 = Cap: Capacitor; Published: 8-Jun-2000; LatestRevisionDate: 17-Jul-2002; LatestRevisionNote: Re-released for DXP Platform.; PackageReference: RAD-0.3; Publisher: Altium Limited; PackageDescription: Radial Cap, Thru-Hole; 2 Leads; 0.3 in Pin Spacing
D11 D12 = Schottky Diode: Generic Schottky Diode
L1 L2 = Inductor: 4.7uH  BWVS005050404R7M00; Code_IEC: 1005; Published: 8-Jun-2000; LatestRevisionDate: 29-May-2009; LatestRevisionNote: IPC-7351 Footprint Added.; PackageReference: 0402-A; Publisher: Altium Limited; PackageDescription: Chip Inductor; Code_JEITA: 0402; Value: Value
Q1 = PMOS: AO3407A PMOS
R21-R28 R82-R84 = Res1: Resistor; Published: 8-Jun-2000; LatestRevisionDate: 17-Jul-2002; LatestRevisionNote: Re-released for DXP Platform.; PackageReference: AXIAL-0.3; Publisher: Altium Limited; PackageDescription: Axial Device, Thru-Hole; 2 Leads; 0.3 in Pin Spacing
R92 = Res1: Resistor; Value: 1%; Published: 8-Jun-2000; LatestRevisionDate: 17-Jul-2002; LatestRevisionNote: Re-released for DXP Platform.; PackageReference: AXIAL-0.3; Publisher: Altium Limited; PackageDescription: Axial Device, Thru-Hole; 2 Leads; 0.3 in Pin Spacing
U5 = Dual Boost TPS65131RGER: IC REG BUCK BST INV ADJ DL 24QFN; Manufacturer: Texas Instruments; Output Voltage: 15V; Output Current: 1.95A; Operating Supply Voltage: 5.5V; Number of Outputs: 2; Efficiency: 85%; Switching Frequency: 1.4MHz; Min Input Voltage: 2.7V; Synchronous Rectifier: No; Min Output Voltage: -15V; Quiescent Current: 500uA; Topology: Buck-Boost; Output Type: Adjustable; Supplier 1: Digi-Key; Manufacturer Part Number: TPS65131RGER; RoHS: Yes; Category: Voltage Regulators - Switching; Stock 1: 7644; Pricing 1: 1=3.00000, 10=2.69400, 25=2.54720, 100=2.20760, 250=2.09436, 500=1.87926, 1000=1.70880 (USD); Case/Package: VQFN EP; Number of Pins: 24; Weight: 0.001524oz; Min Operating Temperature: -40°C; Max Operating Temperature: 85°C; Package Quantity: 3000; Packaging: Tape and Reel; Series: -; Max Input Voltage: 5.5V; Max Output Voltage: 15V; Radiation Hardening: No; Lead Free: Lead Free; RoHS Compliant: Yes; ComponentLink1URL: https://datasheet.ciiva.com/4119/40762122s8213930n7713-4119696.pdf?src-supplier=Arrow+Electronics; ComponentLink1Description: https://datasheet.ciiva.com/4119/40762122s8213930n7713-4119696.pdf?src-supplier=Arrow+Electronics; ComponentLink2URL: https://datasheet.ciiva.com/14378/tps65130-14378346.pdf?src-supplier=Avnet; ComponentLink2Description: https://datasheet.ciiva.com/14378/tps65130-14378346.pdf?src-supplier=Avnet; ComponentLink3URL: https://datasheet.ciiva.com/15223/getdatasheetpartid-254483-15223079.pdf?src-supplier=Verical; ComponentLink3Description: https://datasheet.ciiva.com/15223/getdatasheetpartid-254483-15223079.pdf?src-supplier=Verical; ComponentLink4URL: https://datasheet.ciiva.com/2035/tps65130-2035332.pdf?src-supplier=Digi-Key; ComponentLink4Description: https://datasheet.ciiva.com/2035/tps65130-2035332.pdf?src-supplier=Digi-Key; Supplier Part Number 1: 296-41760-1-ND
U6 = CMP-04917-000111-2: None; Output Configuration: Positive; Number of Regulators: 1; Quiescent Current: 50uA; Max Input Voltage: 5.5V; Dropout Voltage: 695mV; Output Type: Fixed; Power Supply Rejection Ratio (PSRR): 55dB; Max Supply Current: 75uA; Output Current: 150mA; Min Output Voltage: 1.8V; Packaging: Cut Tape; Mount: Surface Mount; Max Operating Temperature: 125°C; Case/Package: SOT-23-5; RoHS Compliant: Yes; Min Operating Temperature: -40°C
U7 = CMP-0784-00426-1: Precision Micropower Shunt Mode Voltage Reference, 5 V Output, Industrial, 3-pin SOT23 (RT-3), Reel; Manufacturer: Analog Devices; Vout: 5V; Ref Out TC (ppm/C): 10; PackageVersion: 011909-C, 02/2009; Packing: Reel; PartNumber: ADR5045BRTZ-REEL7; ComponentLink4URL: Product URL:http://www.analog.com/en/special-linear-functions/voltage-references/adr5045/products/product.html; Code_JEDEC: TO-236-AB; Mounting Technology: Surface Mount; ComponentLink4Description: URL Link1; ComponentLink2Description: Datasheet; ComponentLink1Description: Manufacturer URL; ComponentLink2URL: http://www.analog.com/static/imported-files/data_sheets/ADR5040_5041_5043_5044_5045.pdf; Operating Temp Range: -40 to 125 degC; DatasheetVersion: Rev. B; ComponentLink3URL: http:/www.analog.com/static/imported-files/packages/PKG_PDF/SOT-23-3 (RT)/RT_3.pdf; ComponentLink3Description: Package Specification; PackageReference: RT-3; PackageDescription: 3-Pin Small Outline Transistor Package, Body 2.9 x 1.3 mm, Pitch 0.96 mm; ComponentLink1URL: http://www.analog.com/en/index.html
U8 = CMP-0324-00120-3: Fixed Regulator with -14.5 to -27 V Input and -12 V Output, 0 to 125 degC, 8-Pin SOIC (D), Green (RoHS & no Sb/Br); Manufacturer: Texas Instruments; Iout(Max)(A): 0.1; Iq(Typ)(mA): 6.5; Code_JEDEC: MS-012AA; PackageReference: D0008A; ComponentLink3Description: URL Link1; Vin(Max)(V): -27; DatasheetVersion: SLVS011D; Eco-Plan: Green (RoHS & no Sb/Br); Vin(Min)(V): -14.5; PackageVersion: revM, Jun-2011; PackageDescription: 8-Pin Plastic Small Outline Integrated Circuit, 4.9 x 3.9 mm, Pitch 1.27 mm Pitch; ComponentLink2Description: Package Specification; Vout(Min)(V): -12; ComponentLink1Description: Datasheet; Mounting Technology: Surface Mount; PartNumber: MC79L12ACDR; Vout(Max)(V): -12; ComponentLink1URL: http://www.ti.com/general/docs/lit/getliterature.tsp?genericPartNumber=MC79L12A&fileType=pdf; ComponentLink2URL: http://www.ti.com/litv/pdf/msoi002j; ComponentLink3URL: Samples URL:http://www.ti.com/product/mc79l12a#samples
U9 = CMP-04917-000204-1: IC REG LINEAR 12V 100MA SOT23-3; Max Input Voltage: 30V; Output Configuration: Positive; Dropout Voltage: 1.1V; Output Type: Fixed; Number of Regulators: 1; Quiescent Current: 5mA; RoHS Compliant: Yes; Min Output Voltage: 12V; Mount: Surface Mount; Max Operating Temperature: 125°C; Min Operating Temperature: -40°C; Output Current: 100mA; Packaging: Cut Tape; Case/Package: TO-236-3

## Sheet Microcontroller.SchDoc: Microcontroller
size B; DrawnBy: Jasper Yun; SheetNumber: 4; SheetTotal: 11; Competition: SAC 2021; Subteam: Avionics; University: McGill University; Location: Montreal, Quebec; Project: Avionics Project Name; MRT: McGill Rocket Team
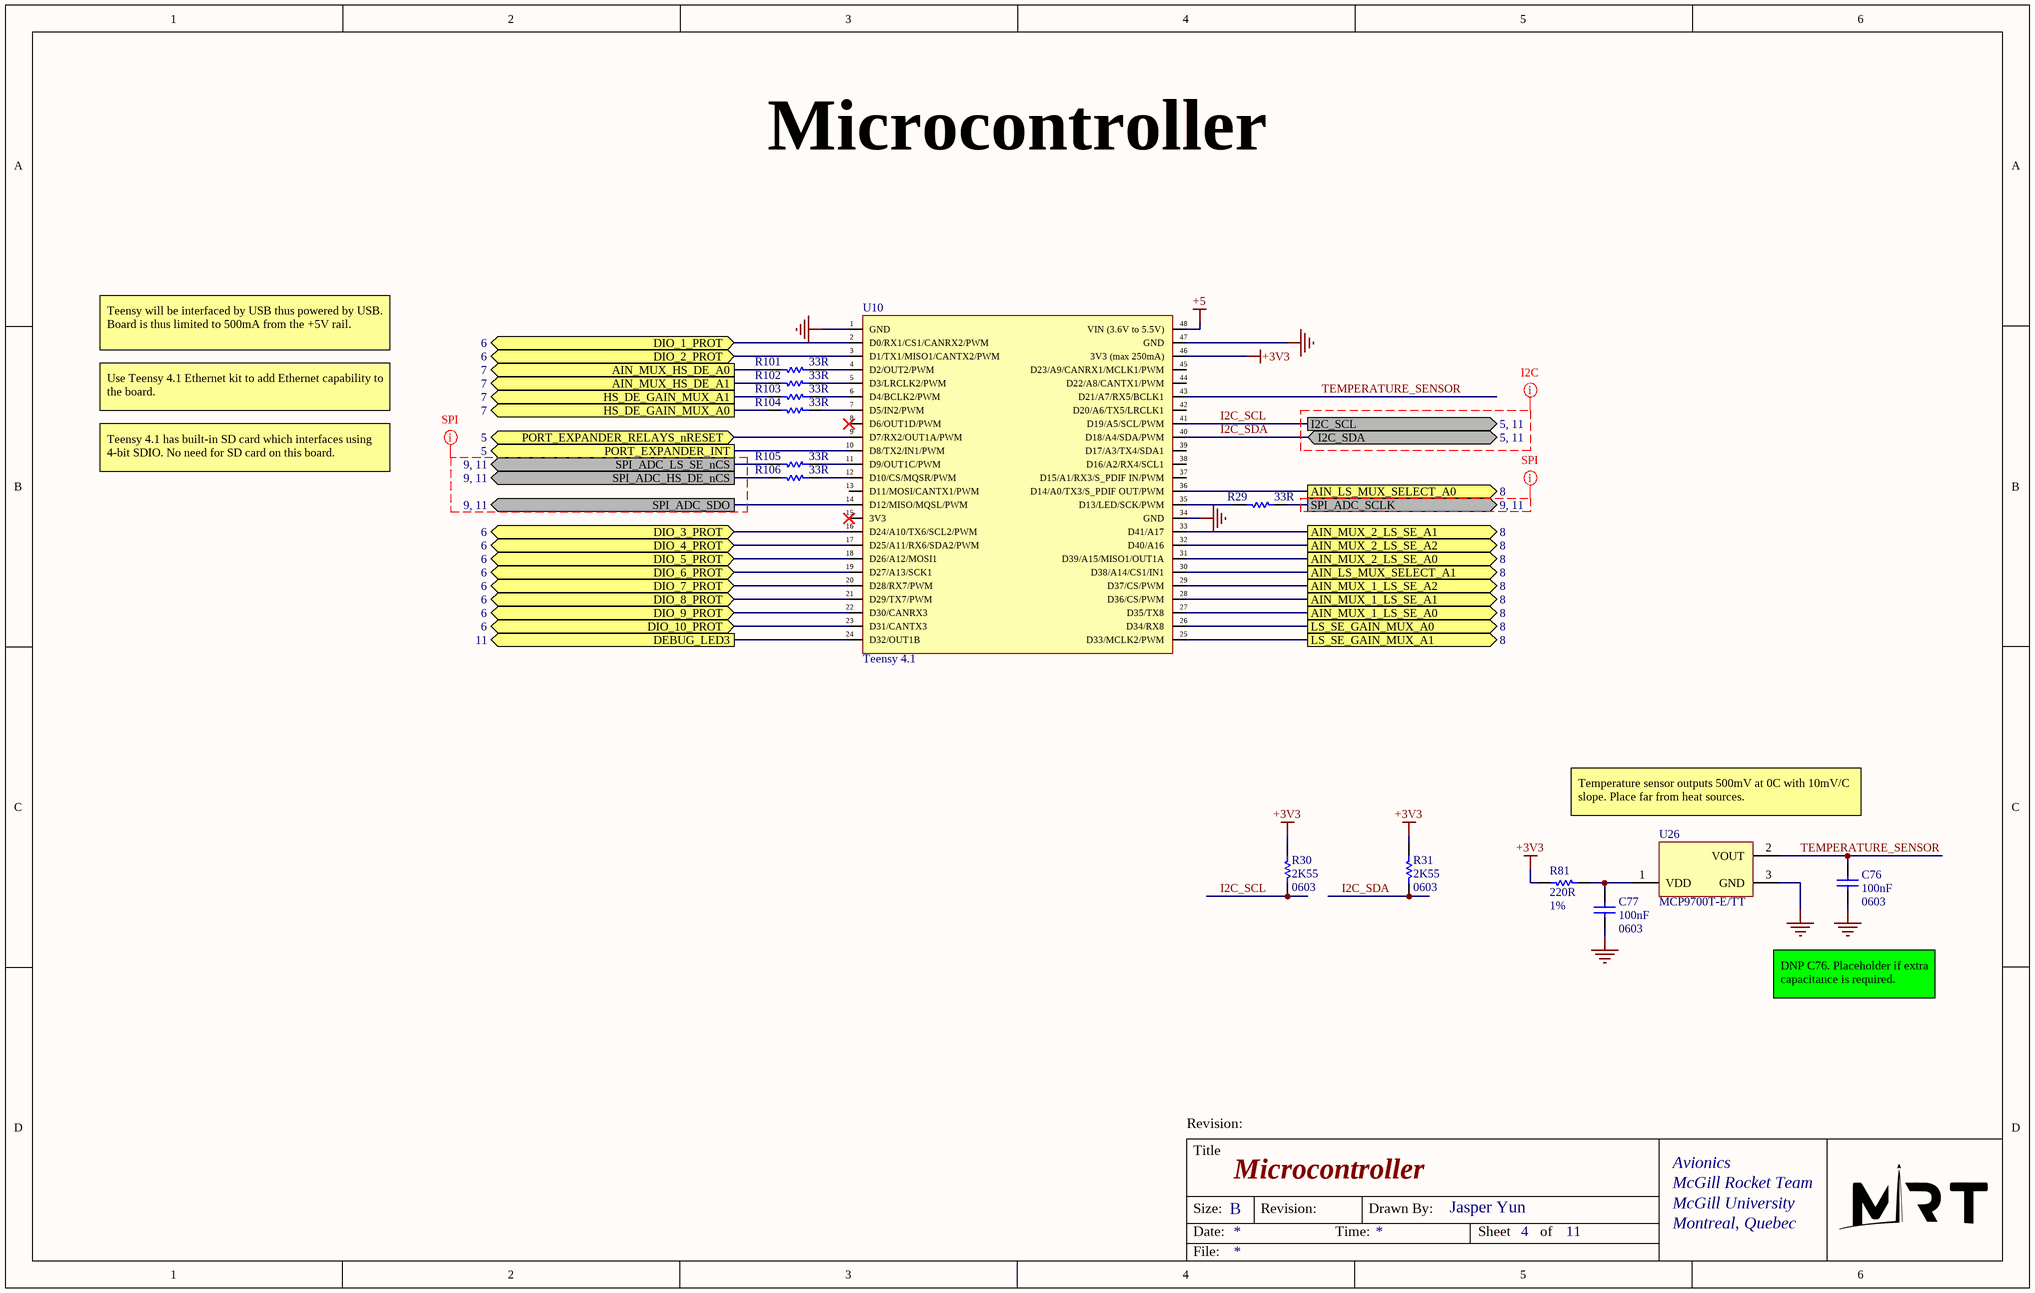
[diagram p3: Microcontroller.SchDoc]

### Parts
C76  100nF  value 0603  [0603 CAP SAMSUNG CL10C]
C77  100nF  value 0603  [0603 CAP SAMSUNG CL10C]
R29  33R  [0603 RES]
R30  2K55  value 0603  [0603 RES]
R31  2K55  value 0603  [0603 RES]
R81  220R  value 1%  [0603 RES]
R101  33R  [0603 RES]
R102  33R  [0603 RES]
R103  33R  [0603 RES]
R104  33R  [0603 RES]
R105  33R  [0603 RES]
R106  33R  [0603 RES]
U10  Teensy 4.1  [Teensy 4.1]
U26  MCP9700T-E/TT  [SOT-23-TT3_M]

### Ports
AIN_LS_MUX_SELECT_A0 (out, see 8), AIN_LS_MUX_SELECT_A1 (out, see 8), AIN_MUX_1_LS_SE_A0 (out, see 8), AIN_MUX_1_LS_SE_A1 (out, see 8), AIN_MUX_1_LS_SE_A2 (out, see 8), AIN_MUX_2_LS_SE_A0 (out, see 8), AIN_MUX_2_LS_SE_A1 (out, see 8), AIN_MUX_2_LS_SE_A2 (out, see 8), AIN_MUX_HS_DE_A0 (out, see 7), AIN_MUX_HS_DE_A1 (out, see 7), DEBUG_LED3 (out, see 11), DIO_1_PROT (bidir, see 6), DIO_2_PROT (bidir, see 6), DIO_3_PROT (bidir, see 6), DIO_4_PROT (bidir, see 6), DIO_5_PROT (bidir, see 6), DIO_6_PROT (bidir, see 6), DIO_7_PROT (bidir, see 6), DIO_8_PROT (bidir, see 6), DIO_9_PROT (bidir, see 6), DIO_10_PROT (bidir, see 6), HS_DE_GAIN_MUX_A0 (out, see 7), HS_DE_GAIN_MUX_A1 (out, see 7), I2C_SCL (out, see 5, 11), I2C_SDA (bidir, see 5, 11), LS_SE_GAIN_MUX_A0 (out, see 8), LS_SE_GAIN_MUX_A1 (out, see 8), PORT_EXPANDER_INT (out, see 5), PORT_EXPANDER_RELAYS_nRESET (bidir, see 5), SPI_ADC_HS_DE_nCS (out, see 9, 11), SPI_ADC_LS_SE_nCS (out, see 9, 11), SPI_ADC_SCLK (out, see 9, 11), SPI_ADC_SDO (out, see 9, 11)

### Nets
+3V3: R30.1 R31.1 R81.1 U10.46(3V3_(max_250mA))
+5: U10.48(VIN_(3.6V_to_5.5V))
GND: C76.1 C77.1 U10.1(GND) U10.34(GND) U10.47(GND) U26.3(GND)
AIN_LS_MUX_SELECT_A0: U10.36(D14/A0/TX3/S_PDIF_OUT/PWM) ; port AIN_LS_MUX_SELECT_A0
AIN_LS_MUX_SELECT_A1: U10.30(D38/A14/CS1/IN1) ; port AIN_LS_MUX_SELECT_A1
AIN_MUX_1_LS_SE_A0: U10.27(D35/TX8) ; port AIN_MUX_1_LS_SE_A0
AIN_MUX_1_LS_SE_A1: U10.28(D36/CS/PWM) ; port AIN_MUX_1_LS_SE_A1
AIN_MUX_1_LS_SE_A2: U10.29(D37/CS/PWM) ; port AIN_MUX_1_LS_SE_A2
AIN_MUX_2_LS_SE_A0: U10.31(D39/A15/MISO1/OUT1A) ; port AIN_MUX_2_LS_SE_A0
AIN_MUX_2_LS_SE_A1: U10.33(D41/A17) ; port AIN_MUX_2_LS_SE_A1
AIN_MUX_2_LS_SE_A2: U10.32(D40/A16) ; port AIN_MUX_2_LS_SE_A2
AIN_MUX_HS_DE_A0: R101.1 ; port AIN_MUX_HS_DE_A0
AIN_MUX_HS_DE_A1: R102.1 ; port AIN_MUX_HS_DE_A1
DEBUG_LED3: U10.24(D32/OUT1B) ; port DEBUG_LED3
DIO_1_PROT: U10.2(D0/RX1/CS1/CANRX2/PWM) ; port DIO_1_PROT
DIO_2_PROT: U10.3(D1/TX1/MISO1/CANTX2/PWM) ; port DIO_2_PROT
DIO_3_PROT: U10.16(D24/A10/TX6/SCL2/PWM) ; port DIO_3_PROT
DIO_4_PROT: U10.17(D25/A11/RX6/SDA2/PWM) ; port DIO_4_PROT
DIO_5_PROT: U10.18(D26/A12/MOSI1) ; port DIO_5_PROT
DIO_6_PROT: U10.19(D27/A13/SCK1) ; port DIO_6_PROT
DIO_7_PROT: U10.20(D28/RX7/PWM) ; port DIO_7_PROT
DIO_8_PROT: U10.21(D29/TX7/PWM) ; port DIO_8_PROT
DIO_9_PROT: U10.22(D30/CANRX3) ; port DIO_9_PROT
DIO_10_PROT: U10.23(D31/CANTX3) ; port DIO_10_PROT
HS_DE_GAIN_MUX_A0: R104.1 ; port HS_DE_GAIN_MUX_A0
HS_DE_GAIN_MUX_A1: R103.1 ; port HS_DE_GAIN_MUX_A1
I2C_SCL: R30.2 U10.41(D19/A5/SCL/PWM) ; port I2C_SCL
I2C_SDA: R31.2 U10.40(D18/A4/SDA/PWM) ; port I2C_SDA
INT: U10.10(D8/TX2/IN1/PWM) ; port PORT_EXPANDER_INT
LS_SE_GAIN_MUX_A0: U10.26(D34/RX8) ; port LS_SE_GAIN_MUX_A0
LS_SE_GAIN_MUX_A1: U10.25(D33/MCLK2/PWM) ; port LS_SE_GAIN_MUX_A1
nRESET: U10.9(D7/RX2/OUT1A/PWM) ; port PORT_EXPANDER_RELAYS_nRESET
SPI_ADC_HS_DE_nCS: R106.1 ; port SPI_ADC_HS_DE_nCS
SPI_ADC_LS_SE_nCS: R105.1 ; port SPI_ADC_LS_SE_nCS
SPI_ADC_SCLK: R29.2 ; port SPI_ADC_SCLK
SPI_ADC_SDO: U10.14(D12/MISO/MQSL/PWM) ; port SPI_ADC_SDO
TEMPERATURE_SENSOR: C76.2 U10.43(D21/A7/RX5/BCLK1) U26.2(VOUT)
NetC77_2: C77.2 R81.2 U26.1(VDD)
NetR29_1: R29.1 U10.35(D13/LED/SCK/PWM)
NetR101_2: R101.2 U10.4(D2/OUT2/PWM)
NetR102_2: R102.2 U10.5(D3/LRCLK2/PWM)
NetR103_2: R103.2 U10.6(D4/BCLK2/PWM)
NetR104_2: R104.2 U10.7(D5/IN2/PWM)
NetR105_2: R105.2 U10.11(D9/OUT1C/PWM)
NetR106_2: R106.2 U10.12(D10/CS/MQSR/PWM)

Not connected (* = marked no-connect by the designer): U10 8(D6/OUT1D/PWM)* 13(D11/MOSI/CANTX1/PWM) 15(3V3)* 37(D15/A1/RX3/S_PDIF_IN/PWM) 38(D16/A2/RX4/SCL1) 39(D17/A3/TX4/SDA1) 42(D20/A6/TX5/LRCLK1) 44(D22/A8/CANTX1/PWM) 45(D23/A9/CANRX1/MCLK1/PWM)

### Layout directives
net class I2C: (no net found under the mark)
net class SPI: (no net found under the mark)

### Notes on the sheet
- Teensy will be interfaced by USB thus powered by USB. Board is thus limited to 500mA from the +5V rail.
- Use Teensy 4.1 Ethernet kit to add Ethernet capability to the board.
- Teensy 4.1 has built-in SD card which interfaces using 4-bit SDIO. No need for SD card on this board.
- Temperature sensor outputs 500mV at 0C with 10mV/C slope. Place far from heat sources.
- DNP C76. Placeholder if extra capacitance is required.
- Title
- Size:
- Date:
- B
- Revision:
- Time:
- Drawn By:
- Sheet
- of
- File:

### Library data of the parts
C76 C77 = Cap: Capacitor; Published: 8-Jun-2000; LatestRevisionDate: 17-Jul-2002; LatestRevisionNote: Re-released for DXP Platform.; PackageReference: RAD-0.3; Publisher: Altium Limited; PackageDescription: Radial Cap, Thru-Hole; 2 Leads; 0.3 in Pin Spacing
R29 R101-R106 = Res1: Resistor; Value: 1%; Published: 8-Jun-2000; LatestRevisionDate: 17-Jul-2002; LatestRevisionNote: Re-released for DXP Platform.; PackageReference: AXIAL-0.3; Publisher: Altium Limited; PackageDescription: Axial Device, Thru-Hole; 2 Leads; 0.3 in Pin Spacing
R30 R31 R81 = Res1: Resistor; Published: 8-Jun-2000; LatestRevisionDate: 17-Jul-2002; LatestRevisionNote: Re-released for DXP Platform.; PackageReference: AXIAL-0.3; Publisher: Altium Limited; PackageDescription: Axial Device, Thru-Hole; 2 Leads; 0.3 in Pin Spacing
U10 = Teensy 4.1: Teensy 4.1 breakout (no ethernet or USB host pins exposed)
U26 = CMP-0192-00220-1: Low-Power Linear Active Thermistor IC, 3-Pin SOT-23, Extended Temperature, Tape and Reel; DatasheetVersion: revE, Apr-2009; PackageVersion: revBB, Aug-2009; PackageReference: SOT-23-TT3; Code_IPC: SOT23-3; PackageDescription: 3-Lead Plastic Small Outline Transistor (TT) [SOT-23]

## Sheet IO Expansion.SchDoc: IO Expansion
size B; DrawnBy: Jasper Yun; SheetNumber: 5; SheetTotal: 11; Competition: SAC 2021; Subteam: Avionics; University: McGill University; Location: Montreal, Quebec; Project: Avionics Project Name; MRT: McGill Rocket Team
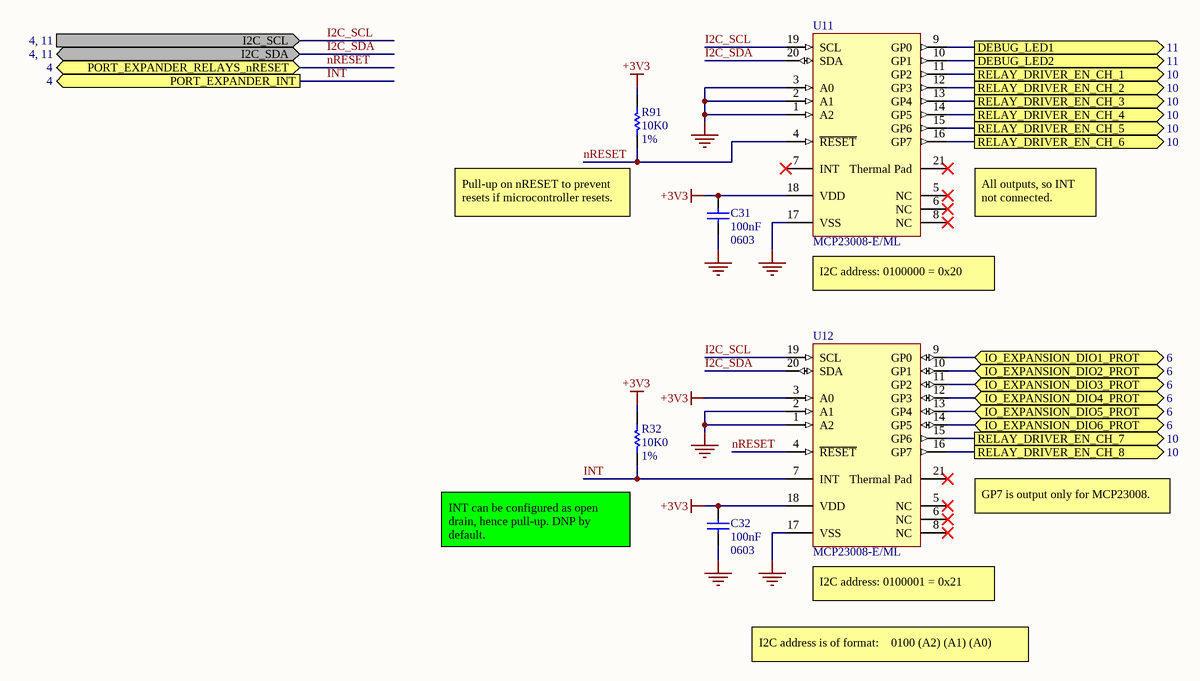
[diagram p4: IO Expansion.SchDoc]

### Parts
C31  100nF  value 0603  [0603 CAP SAMSUNG CL10C]
C32  100nF  value 0603  [0603 CAP SAMSUNG CL10C]
R32  10K0  value 1%  [0603 RES]
R91  10K0  value 1%  [0603 RES]
U11  MCP23008-E/ML  [QFN-ML20_M]
U12  MCP23008-E/ML  [QFN-ML20_M]

### Ports
DEBUG_LED1 (out, see 11), DEBUG_LED2 (out, see 11), I2C_SCL (in, see 4, 11), I2C_SDA (bidir, see 4, 11), IO_EXPANSION_DIO1_PROT (bidir, see 6), IO_EXPANSION_DIO2_PROT (bidir, see 6), IO_EXPANSION_DIO3_PROT (bidir, see 6), IO_EXPANSION_DIO4_PROT (bidir, see 6), IO_EXPANSION_DIO5_PROT (bidir, see 6), IO_EXPANSION_DIO6_PROT (bidir, see 6), PORT_EXPANDER_INT (out, see 4), PORT_EXPANDER_RELAYS_nRESET (bidir, see 4), RELAY_DRIVER_EN_CH_1 (out, see 10), RELAY_DRIVER_EN_CH_2 (out, see 10), RELAY_DRIVER_EN_CH_3 (out, see 10), RELAY_DRIVER_EN_CH_4 (out, see 10), RELAY_DRIVER_EN_CH_5 (out, see 10), RELAY_DRIVER_EN_CH_6 (out, see 10), RELAY_DRIVER_EN_CH_7 (out, see 10), RELAY_DRIVER_EN_CH_8 (out, see 10)

### Nets
+3V3: C31.2 C32.2 R32.1 R91.1 U11.18(VDD) U12.3(A0) U12.18(VDD)
GND: C31.1 C32.1 U11.1(A2) U11.2(A1) U11.3(A0) U11.17(VSS) U12.1(A2) U12.2(A1) U12.17(VSS)
DEBUG_LED1: U11.9(GP0) ; port DEBUG_LED1
DEBUG_LED2: U11.10(GP1) ; port DEBUG_LED2
I2C_SCL: U11.19(SCL) U12.19(SCL) ; port I2C_SCL
I2C_SDA: U11.20(SDA) U12.20(SDA) ; port I2C_SDA
INT: R32.2 U12.7(INT) ; port PORT_EXPANDER_INT
IO_EXPANSION_DIO1_PROT: U12.9(GP0) ; port IO_EXPANSION_DIO1_PROT
IO_EXPANSION_DIO2_PROT: U12.10(GP1) ; port IO_EXPANSION_DIO2_PROT
IO_EXPANSION_DIO3_PROT: U12.11(GP2) ; port IO_EXPANSION_DIO3_PROT
IO_EXPANSION_DIO4_PROT: U12.12(GP3) ; port IO_EXPANSION_DIO4_PROT
IO_EXPANSION_DIO5_PROT: U12.13(GP4) ; port IO_EXPANSION_DIO5_PROT
IO_EXPANSION_DIO6_PROT: U12.14(GP5) ; port IO_EXPANSION_DIO6_PROT
nRESET: R91.2 U11.4(~{RESET}) U12.4(~{RESET}) ; port PORT_EXPANDER_RELAYS_nRESET
RELAY_DRIVER_EN_CH_1: U11.11(GP2) ; port RELAY_DRIVER_EN_CH_1
RELAY_DRIVER_EN_CH_2: U11.12(GP3) ; port RELAY_DRIVER_EN_CH_2
RELAY_DRIVER_EN_CH_3: U11.13(GP4) ; port RELAY_DRIVER_EN_CH_3
RELAY_DRIVER_EN_CH_4: U11.14(GP5) ; port RELAY_DRIVER_EN_CH_4
RELAY_DRIVER_EN_CH_5: U11.15(GP6) ; port RELAY_DRIVER_EN_CH_5
RELAY_DRIVER_EN_CH_6: U11.16(GP7) ; port RELAY_DRIVER_EN_CH_6
RELAY_DRIVER_EN_CH_7: U12.15(GP6) ; port RELAY_DRIVER_EN_CH_7
RELAY_DRIVER_EN_CH_8: U12.16(GP7) ; port RELAY_DRIVER_EN_CH_8

Not connected (* = marked no-connect by the designer): U11 5(NC)* 6(NC)* 7(INT)* 8(NC)* 21(Thermal_Pad)*; U12 5(NC)* 6(NC)* 8(NC)* 21(Thermal_Pad)*

### Notes on the sheet
- (near R91) Pull-up on nRESET to prevent resets if microcontroller resets.
- All outputs, so INT not connected.
- (near U11) I2C address: 0100000 = 0x20
- (near R32) INT can be configured as open drain, hence pull-up. DNP by default.
- GP7 is output only for MCP23008.
- (near U12) I2C address: 0100001 = 0x21
- I2C address is of format:    0100 (A2) (A1) (A0)
- Title
- Size:
- Date:
- B
- Revision:
- Time:
- Drawn By:
- Sheet
- of
- File:

### Library data of the parts
C31 C32 = Cap: Capacitor; Published: 8-Jun-2000; LatestRevisionDate: 17-Jul-2002; LatestRevisionNote: Re-released for DXP Platform.; PackageReference: RAD-0.3; Publisher: Altium Limited; PackageDescription: Radial Cap, Thru-Hole; 2 Leads; 0.3 in Pin Spacing
R32 R91 = Res1: Resistor; Published: 8-Jun-2000; LatestRevisionDate: 17-Jul-2002; LatestRevisionNote: Re-released for DXP Platform.; PackageReference: AXIAL-0.3; Publisher: Altium Limited; PackageDescription: Axial Device, Thru-Hole; 2 Leads; 0.3 in Pin Spacing
U11 U12 = CMP-0186-00018-2: 8-Bit I/O Expander with Serial Interface, 20-Pin QFN, Extended Temperature; ComponentLink2URL: http://ww1.microchip.com/downloads/en/DeviceDoc/21919e.pdf; ComponentLink1Description: Manufacturer URL; ComponentLink3Description: Package Specification; ComponentLink1URL: http://www.microchip.com/; RevisionNote: URLs added.; PackageReference: QFN-ML20; ComponentLink2Description: Datasheet; PackageDescription: 20-Lead Plastic Quad Flat, No Lead Package (ML) - 4x4x0.9 mm Body [QFN]; ComponentLink3URL: http://www.microchip.com/stellent/groups/techpub_sg/documents/packagingspec/en012702.pdf; DatasheetVersion: revE, Aug-2007; PackageVersion: revBB, Aug-2009